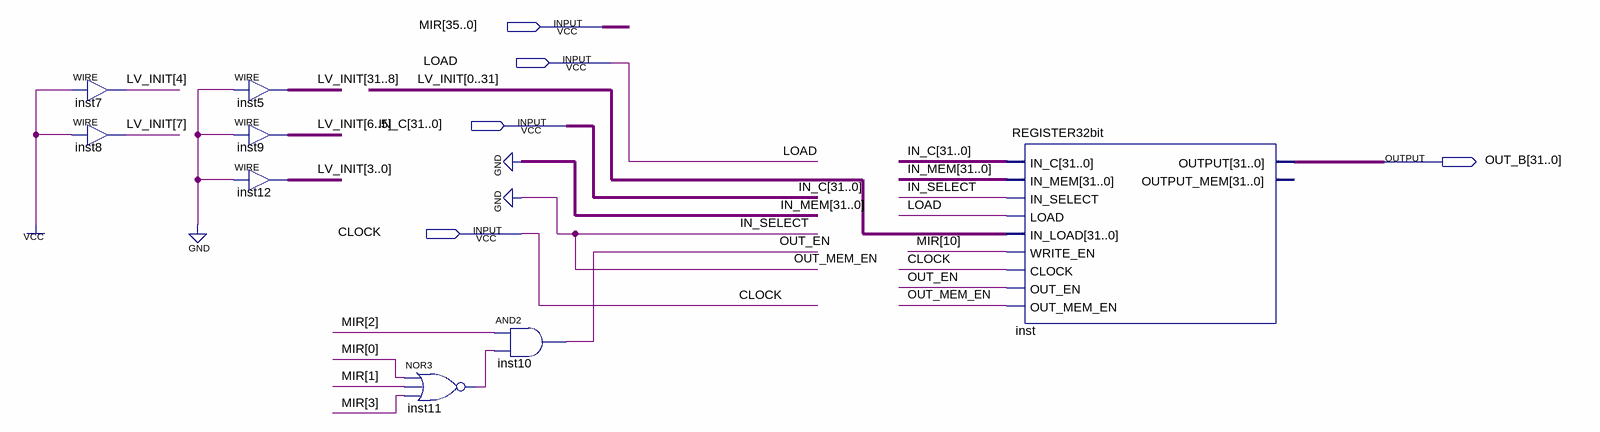
[diagram p0: schematic sheet]
// Quartus schematic SP.bdf as structural Verilog: 8 symbols, 5 pins
module SP (
  input  [35:0] MIR,
  input  LOAD,
  input  [31:0] IN_C,
  input  CLOCK,
  output [31:0] OUT_B
);

  wire inst11_out, OUT_EN;
  wire [31:0] LV_INIT;

  assign LV_INIT[4] = 1'b1;  // WIRE inst7
  assign LV_INIT[7] = 1'b1;  // WIRE inst8
  assign LV_INIT[31:8] = {24{1'b0}};  // WIRE inst5
  assign LV_INIT[6:5] = 2'b00;  // WIRE inst9
  assign LV_INIT[3:0] = 4'b0000;  // WIRE inst12
  nor inst11 (inst11_out, MIR[0], MIR[1], MIR[3]);
  and inst10 (OUT_EN, MIR[2], inst11_out);
  REGISTER32bit inst (
    .IN_C(IN_C), .IN_MEM({32{1'b0}}), .IN_SELECT(1'b0), .LOAD(LOAD),
    .IN_LOAD({LV_INIT[0], LV_INIT[1], LV_INIT[2], LV_INIT[3], LV_INIT[4], LV_INIT[5], LV_INIT[6], LV_INIT[7], LV_INIT[8], LV_INIT[9], LV_INIT[10], LV_INIT[11], LV_INIT[12], LV_INIT[13], LV_INIT[14], LV_INIT[15], LV_INIT[16], LV_INIT[17], LV_INIT[18], LV_INIT[19], LV_INIT[20], LV_INIT[21], LV_INIT[22], LV_INIT[23], LV_INIT[24], LV_INIT[25], LV_INIT[26], LV_INIT[27], LV_INIT[28], LV_INIT[29], LV_INIT[30], LV_INIT[31]}),
    .WRITE_EN(MIR[10]), .CLOCK(CLOCK), .OUT_EN(OUT_EN), .OUT_MEM_EN(1'b0), .OUTPUT(OUT_B));  // open: OUTPUT_MEM
endmodule
